# EAGLE design 2out_0-10V_2te (EAGLE 6.3)
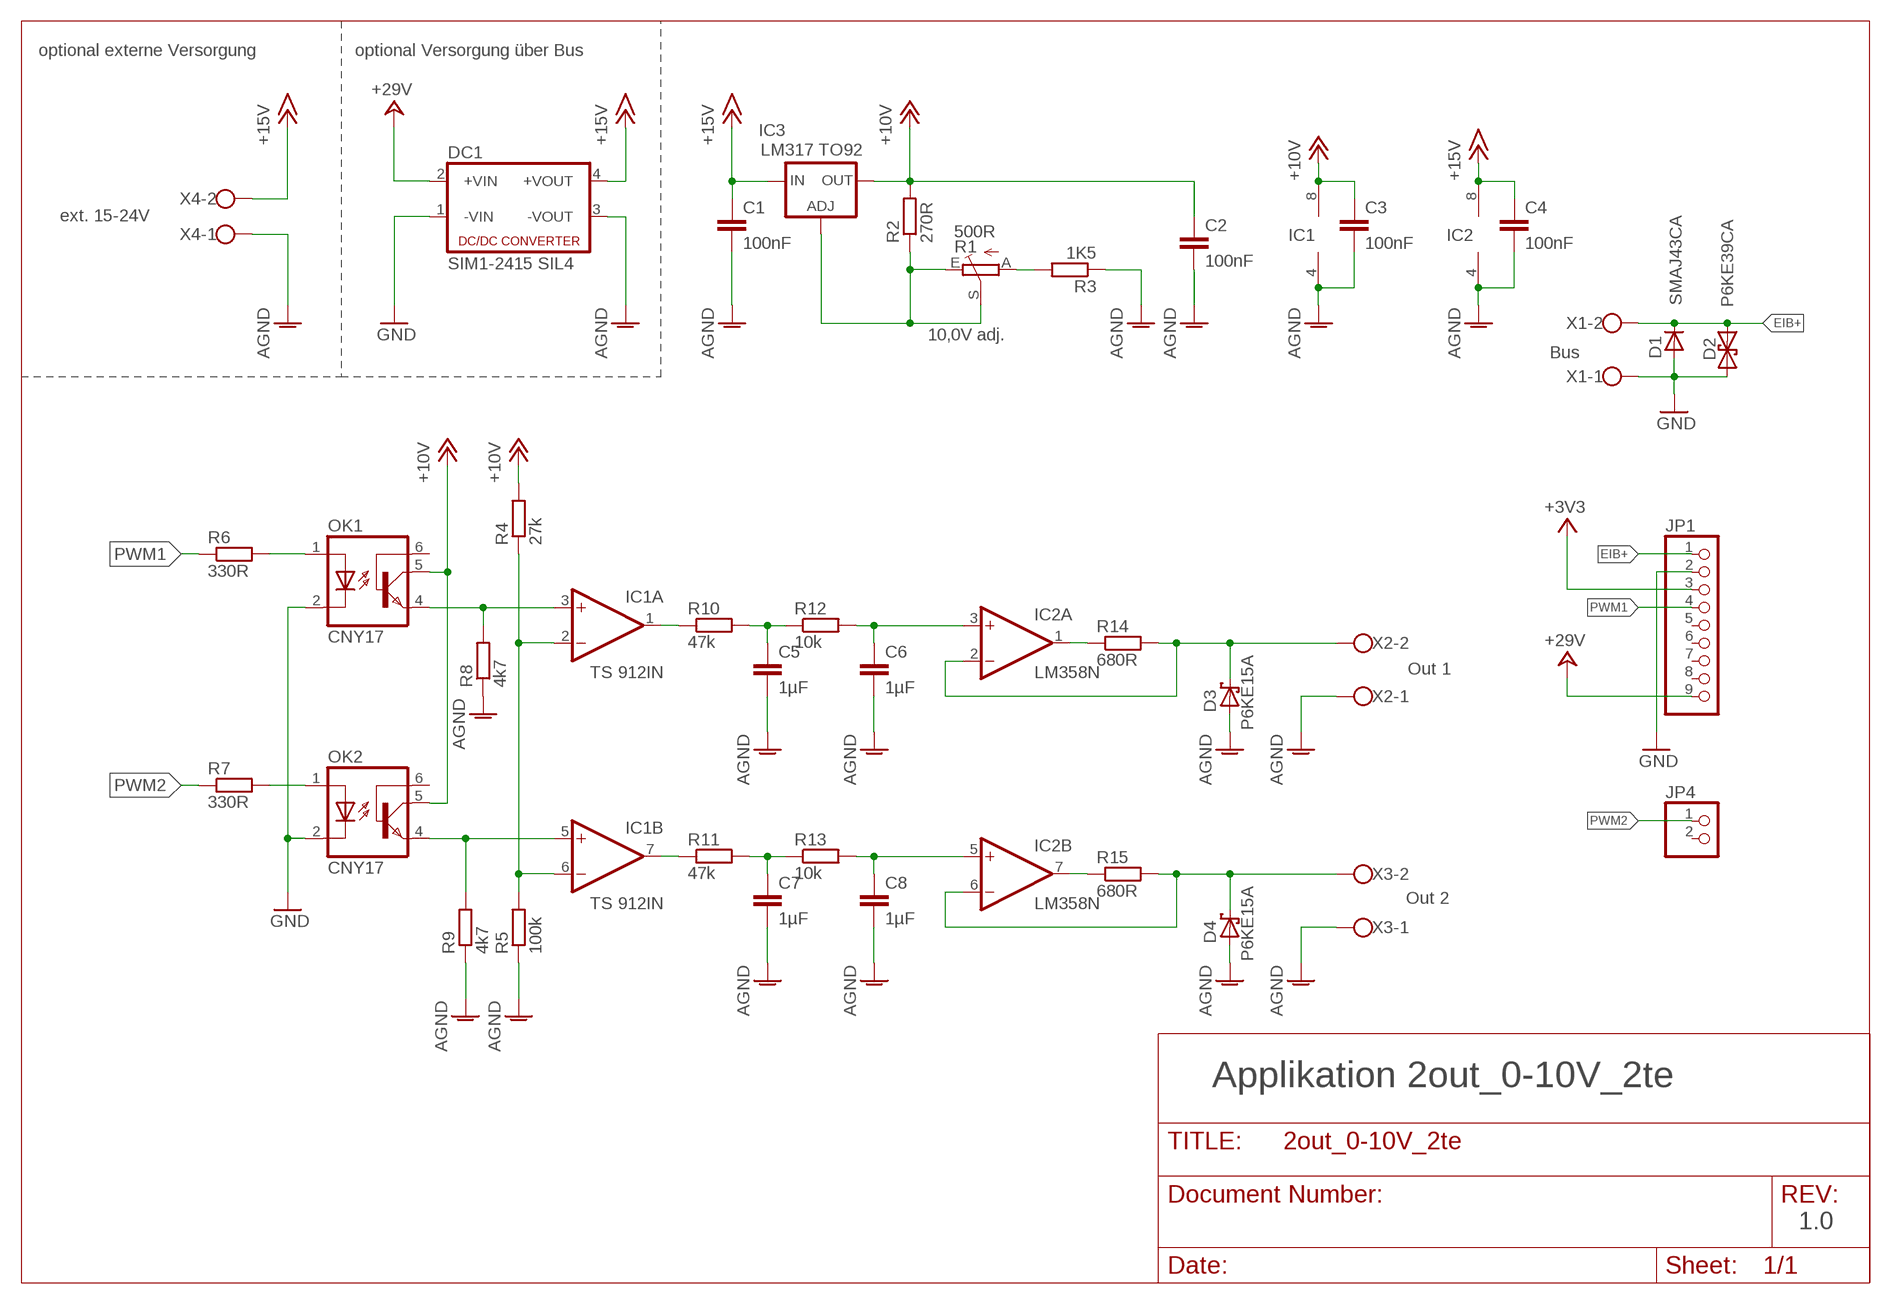
[diagram p0: schematic, sheet 1]

## Parts
C1  100nF  C-EU025-024X044  [C025-024X044]
C2  100nF  C-EU025-024X044  [C025-024X044]
C3  100nF  C-EU025-024X044  [C025-024X044]
C4  100nF  C-EU025-024X044  [C025-024X044]
C5  1µF  C-EU050-024X044  [C050-024X044]
C6  1µF  C-EU050-024X044  [C050-024X044]
C7  1µF  C-EU050-024X044  [C050-024X044]
C8  1µF  C-EU050-024X044  [C050-024X044]
D1  SMAJ43CA  D-SOD-87  [SOD87]
D2  P6KE39CA  P6KEXXCDO41-7  [DO41-7]
D3  P6KE15A  P6KEXXADO41-7  [DO41-7]
D4  P6KE15A  P6KEXXADO41-7  [DO41-7]
DC1  SIM1-2415 SIL4  NME  [NME]
IC1  TS 912IN  LM358N  [DIL08]
IC2  LM358N  [DIL08]
IC3  LM317 TO92  LM317L  [317L]
JP1  PINHD-1X9  [1X09]
JP4  PINHD-1X2  [1X02]
OK1  CNY17  [DIL06]
OK2  CNY17  [DIL06]
R1  500R  TRIM_EU-B64W  [B64W]
R2  270R  R-EU_0207/7  [0207/7]
R3  1K5  R-EU_0207/7  [0207/7]
R4  27k  R-EU_0207/7  [0207/7]
R5  100k  R-EU_0207/7  [0207/7]
R6  330R  R-EU_0207/7  [0207/7]
R7  330R  R-EU_0207/7  [0207/7]
R8  4k7  R-EU_0207/7  [0207/7]
R9  4k7  R-EU_0207/7  [0207/7]
R10  47k  R-EU_0207/7  [0207/7]
R11  47k  R-EU_0207/7  [0207/7]
R12  10k  R-EU_0207/7  [0207/7]
R13  10k  R-EU_0207/7  [0207/7]
R14  680R  R-EU_0207/7  [0207/7]
R15  680R  R-EU_0207/7  [0207/7]
X1  W237-02P  [W237-132]
X2  W237-02P  [W237-132]
X3  W237-02P  [W237-132]
X4  W237-02P  [W237-132]

## Nets
+3V3: JP1.3
+12V: C2.1 C3.1 IC1.8(P:V+) IC3.2(OUT) OK1.5(COL) OK2.5(COL) R2.2 R4.2 ; supply symbol labelled +10V
+15V: C1.1 C4.1 DC1.4(+VOUT) IC2.8(P:V+) IC3.3(IN) X4.2
+29V: DC1.2(+VIN) JP1.9
AGND: C1.2 C2.2 C3.2 C4.2 C5.2 C6.2 C7.2 C8.2 D3.A D4.A DC1.3(-VOUT) IC1.4(P:V-) IC2.4(P:V-) R3.1 R5.1 R8.1 R9.1 X2.1 X3.1 X4.1
EIB+: D1.1(C) D2.C JP1.1 X1.2
GND: D1.2(A) D2.A DC1.1(-VIN) JP1.2 OK1.2(C) OK2.2(C) X1.1
N$1: IC1.7(B:OUT) R11.1
N$2: OK2.1(A) R7.2
N$3: OK1.1(A) R6.2
N$4: C7.1 R11.2 R13.1
N$5: IC3.1(ADJ) R1.E R1.S R2.1
N$6: R1.A R3.2
N$7: IC1.3(A:+IN) OK1.4(EMI) R8.2
N$8: IC1.2(A:-IN) IC1.6(B:-IN) R4.1 R5.2
N$9: C8.1 IC2.5(B:+IN) R13.2
N$10: IC2.7(B:OUT) R15.1
N$11: IC1.5(B:+IN) OK2.4(EMI) R9.2
N$12: IC1.1(A:OUT) R10.1
N$13: C5.1 R10.2 R12.1
N$14: C6.1 IC2.3(A:+IN) R12.2
N$15: IC2.1(A:OUT) R14.1
OUT_1: D3.C IC2.2(A:-IN) R14.2 X2.2
OUT_2: D4.C IC2.6(B:-IN) R15.2 X3.2
PWM1: JP1.4 R6.1
PWM2: JP4.1 R7.1
Unconnected: JP1.5 JP1.6 JP1.7 JP1.8 JP4.2 OK1.6(BAS) OK2.6(BAS)

## Notes on the sheet
- optional externe Versorgung | optional Versorgung über Bus
- ext. 15-24V
- IC1 | IC2
- 10,0V adj.
- Bus
- Out 1
- Out 2
- Applikation 2out_0-10V_2te
- 1.0

## Library data of the parts
C1-C8 = rcl:C-EU: CAPACITOR, European symbol
D1 = semicon-smd-ipc:D-: DIODE unfilled
D2 = diode:P6KEXXC: DIODE transient-voltage suppressor
D3 D4 = diode:P6KEXXA: DIODE transient-voltage suppressor
DC1 = dc-dc-converter:NME: DC-DC CONVERTER
IC1 IC2 = linear:LM358: OP AMP also LM158; LM258; LM2904 Source: http://cache.national.com/ds/LM/LM158.pdf
IC3 = v-reg:LM317L: VOLTAGE REGULATOR
JP1 = pinhead:PINHD-1X9: PIN HEADER
JP4 = pinhead:PINHD-1X2: PIN HEADER
OK1 OK2 = Uwe:CNY17: SIEMENS OPTO COUPLER; MPN: CNY17-1; OC_FARNELL: 1045399; OC_NEWARK: 05M4044
R1 = pot:TRIM_EU-: POTENTIOMETER
R2-R15 = rcl:R-EU_: RESISTOR, European symbol
X1-X4 = con-wago-508:W237-02P: WAGO SREW CLAMP

## Board
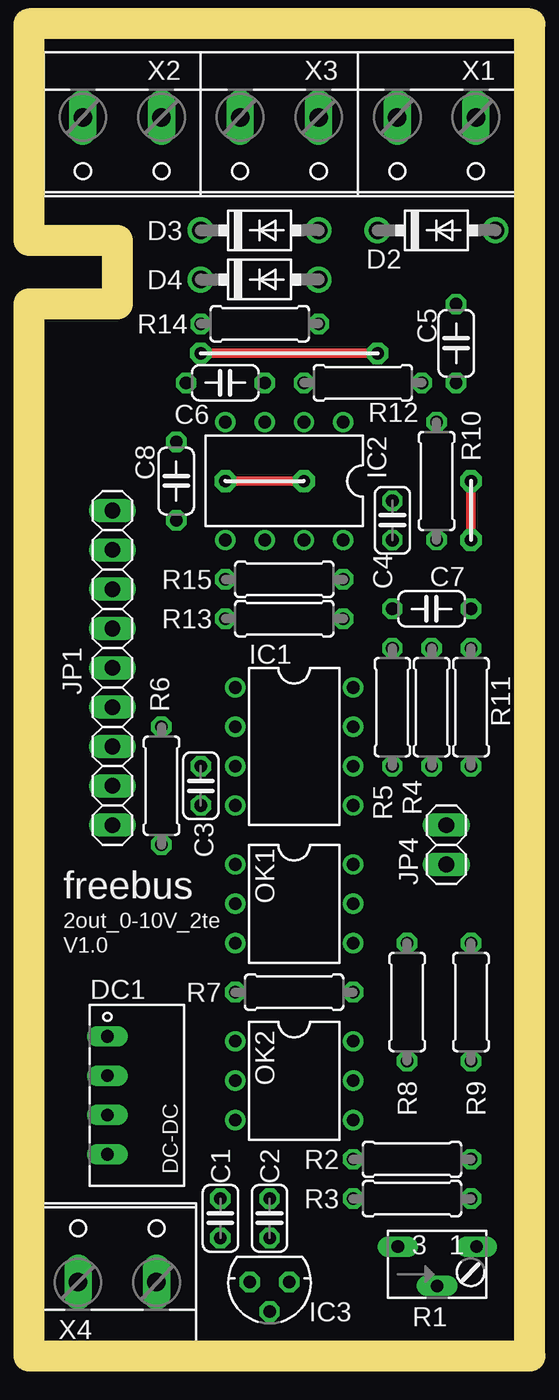
[diagram p1: board, top side]
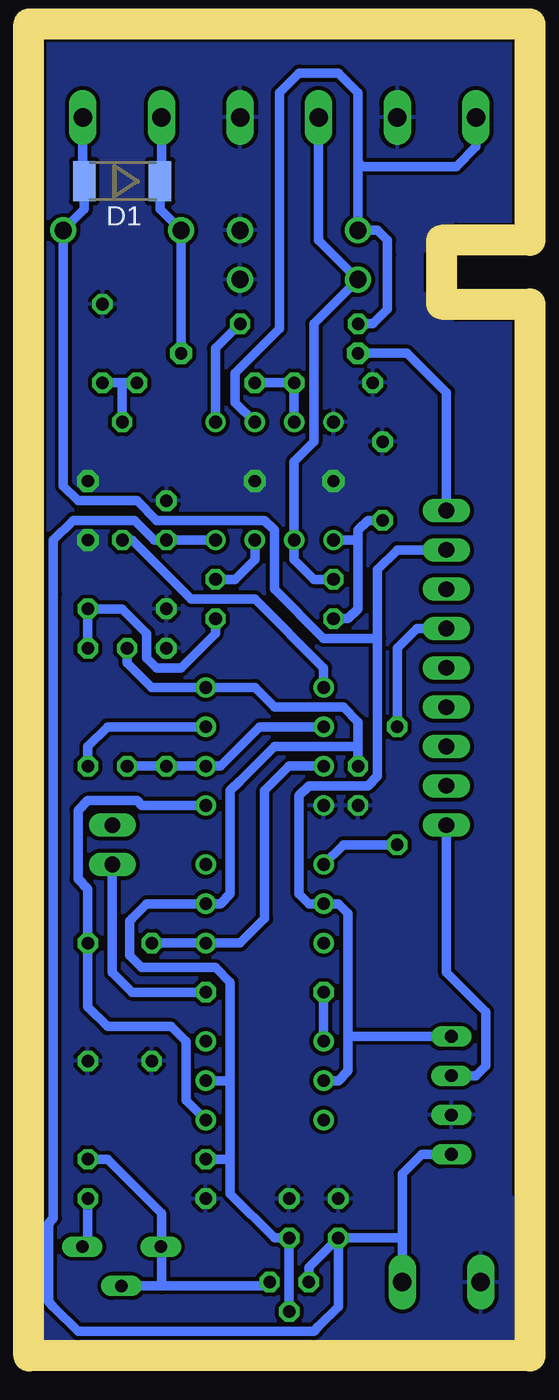
[diagram p2: board, bottom side, seen from below]

Size 31.11 x 85.41 mm. Coordinates in mm from the lower left corner, seen from the top.
Outline: 0,0 0,10.79 0.32,10.79 0.32,67.31 4.13,67.31 6.03,69.22 6.03,71.44 4.13,73.34 0.32,73.34 0.32,85.41 30.8,85.41 30.8,10.79 31.11,10.79 31.11,0 0,0
Copper layers (1*16): Top 0.035mm / dielectric 1.5mm / Bottom 0.035mm
Design rules "platinensammler_02 *": minimum track width 0.1mm, minimum drill 0.7mm, track to track 0.252mm, track to pad 0.252mm, pad to pad 0.252mm, via to via 0.252mm, smd to smd 0.252mm, copper to edge 0.2mm, drill to drill 0.2mm, minimum pad ring 0.25mm, minimum via ring 0.3mm, stop-mask expansion 4mil, vias tented up to drill 0.8mm, thermal gap 0.26mm
Milling: 8 lines

### Footprints (pad centres in the part's own frame; a part is rotated, then mirrored left to right if it is on the bottom)
C025-024X044 = drill 0.813 octagon: 1 -1.27,0; 2 1.27,0
C050-024X044 = drill 0.813 octagon: 1 -2.54,0; 2 2.54,0
SOD87 = smd 1.45 x 2.6: 1 -2.445,0; 2 2.445,0
DO41-7 = drill 1.118: A 3.81,0; C -3.81,0
NME = drill 0.813 long: 1 0,3.81; 2 0,1.27; 3 0,-1.27; 4 0,-3.81
DIL08 = drill 0.813 pad 1.27: 1 -3.81,-3.81; 2 -1.27,-3.81; 3 1.27,-3.81; 4 3.81,-3.81; 5 3.81,3.81; 6 1.27,3.81; 7 -1.27,3.81; 8 -3.81,3.81
317L = drill 0.813 octagon: 1 -1.27,0; 2 0,1.905; 3 1.27,0
1X09 = drill 1.016 long: 1 -10.16,0; 2 -7.62,0; 3 -5.08,0; 4 -2.54,0; 5 0,0; 6 2.54,0; 7 5.08,0; 8 7.62,0; 9 10.16,0
1X02 = drill 1.016 long: 1 0,0; 2 2.54,0
DIL06 = drill 0.813: 1 -2.54,-3.81; 2 0,-3.81; 3 2.54,-3.81; 4 2.54,3.81; 5 0,3.81; 6 -2.54,3.81
B64W = drill 0.813 long: A 2.54,0; E -2.54,0; S 0,-2.54
0207/7 = drill 0.813 octagon: 1 -3.81,0; 2 3.81,0
W237-132 = drill 1.194 long: 1 -2.54,-0.635; 2 2.54,-0.635

### Placement (x,y rotation side)
C1  11.75,9.21 90 top
C2  14.92,9.21 90 top
C3  10.48,37.15 270 top
C4  22.86,54.29 90 top
C5  26.99,65.72 90 top
C6  12.06,63.18 180 top
C7  25.4,48.58 180 top
C8  8.89,56.83 90 top
D1  25.72,76.2 180 bottom
D2  25.72,73.03 0 top
D3  14.29,73.03 0 top
D4  14.29,69.85 0 top
DC1  4.45,17.14 0 top
IC1  16.51,39.69 270 top
IC2  15.88,56.83 180 top
IC3  14.92,5.08 180 top
JP1  4.76,44.77 270 top
JP4  26.35,32.07 90 top
OK1  16.51,29.53 270 top
OK2  16.51,18.1 270 top
R1  25.76,7.38 0 top
R2  24.13,13.02 180 top
R3  24.13,10.48 0 top
R4  25.4,42.23 90 top
R5  22.86,42.23 270 top
R6  7.94,37.15 270 top
R7  16.51,23.81 180 top
R8  23.81,23.18 90 top
R9  27.94,23.18 90 top
R10  25.72,56.83 90 top
R11  27.94,42.23 90 top
R12  20.95,63.18 180 top
R13  15.88,47.94 180 top
R14  14.29,66.99 180 top
R15  15.88,50.48 180 top
X1  25.72,79.69 180 top
X2  5.4,79.69 180 top
X3  15.56,79.69 180 top
X4  5.08,5.71 0 top

### Tracks (layer width: path | path; a pad name or v marks a point on that pad's centre or on a via)
+12V
  Bottom 0.61: IC3.2 C2.1 15.88,7.94 18.73,10.79 18.73,13.02 | 18.73,18.1 18.73,24.45 19.68,25.4 24.45,25.4 25.24,26.19 25.24,28.42 25.08,28.57 24.13,29.53 OK1.5 19.37,29.53 18.73,30.16 18.73,36.83 18.1,37.47 15.88,39.69 10.48,39.69 | 18.73,18.1 18.73,17.46 18.73,13.02 | OK2.5 18.73,18.1 | R4.2 25.4,45.09 23.81,43.5 IC1.8 17.14,43.5 15.88,42.23 11.43,42.23 10.48,41.27 10.48,39.69 | 10.48,39.69 C3.1 | R2.2 18.73,13.02
+15V
  Bottom 0.61: IC3.3 13.65,6.03 C1.1 | C1.1 11.75,3.49 13.02,2.22 13.34,1.91 28.57,1.91 30.16,3.49 30.48,3.81 30.48,8.89 30.16,9.21 30.16,49.53 30.16,53.02 28.89,54.29 24.92,54.29 23.65,53.02 C4.1 IC2.8 | DC1.4 6.35,13.34 7.62,12.06 7.62,7.94 | 7.62,7.94 X4.2 | C1.1 7.62,7.94
+29V
  Bottom 0.61: DC1.2 3.17,18.41 2.86,18.41 2.22,19.05 2.22,22.54 4.76,25.08 JP1.9
AGND  (via drill 0.8)
  Top 0.61: v17.14,56.83 v12.06,56.83 | v27.94,56.83 v27.94,53.02
  pour Bottom (isolate 0.1, rank 6): 0,0 30.8,0 30.8,85.41 0,85.41 0.32,73.34 4.13,73.34 6.03,71.44 6.03,69.22 4.13,67.31 0.32,67.31
EIB+  (via drill 0.8)
  Top 0.61: v10.48,65.09 v21.91,65.09
  Bottom 0.61: X1.2 23.18,76.3 D1.1 23.27,74.39 D2.C v21.91,65.09 | JP1.1 4.76,62.55 7.3,65.09 v10.48,65.09
GND
  Bottom 0.61: OK2.2 11.75,18.1 11.11,18.73 11.11,20.95 | 11.11,20.95 11.11,28.89 11.75,29.53 OK1.2 13.65,29.53 14.29,30.16 14.29,36.51 13.65,37.15 9.84,37.15 9.21,37.78 9.21,46.67 | DC1.1 11.11,20.95 | 9.21,46.67 9.21,51.12 7.94,52.39 JP1.2 | 9.21,46.67 12.7,46.67 15.88,49.85 15.88,53.02 15.88,53.66 16.51,54.29 23.5,54.29 24.77,55.56 28.57,55.56 29.53,56.52 D2.A 28.16,74.39 D1.2 28.26,76.3 X1.1
N$1
  Bottom 0.61: IC1.7 26.67,40.96 27.94,39.69 R11.1
N$2
  Bottom 0.61: R7.2 OK2.1
N$3
  Bottom 0.61: R6.2 11.43,33.34 OK1.1
N$4
  Bottom 0.61: R13.1 19.68,46.99 21.91,44.77 23.5,44.77 24.13,45.4 24.13,46.99 25.72,48.58 C7.1 R11.2
N$5
  Bottom 0.61: R2.1 26.67,13.02 23.18,9.53 23.18,7.42 R1.E 23.18,7.33 23.18,4.83 | IC3.1 16.44,4.83 23.18,4.83 | 23.18,4.83 R1.S
N$6
  Bottom 0.61: R3.2 27.94,7.74 R1.A
N$7
  Bottom 0.61: IC1.3 14.92,38.42 16.51,36.83 16.51,28.57 18.1,26.99 OK1.4 R8.2
N$8
  Bottom 0.61: R4.1 R5.2 IC1.6 19.37,38.42 16.83,40.96 IC1.2
N$9
  Bottom 0.61: R13.2 11.11,47.94 10.48,48.58 10.48,53.02 | IC2.5 10.48,53.02 | C8.1 9.84,54.29 10.48,53.66 10.48,53.02
N$10
  Bottom 0.61: IC2.7 17.14,51.75 18.41,50.48 R15.1
N$11
  Bottom 0.61: OK2.4 21.59,16.83 21.59,20.32 21.59,20.64 22.54,21.59 26.67,21.59 27.94,22.86 R9.2 27.94,30.48 28.57,31.11 28.57,35.56 27.94,36.2 24.77,36.2 24.45,35.88 IC1.5
N$12
  Bottom 0.61: IC1.1 12.7,44.77 17.14,49.21 21.27,49.21 25.08,53.02 R10.1
N$13
  Bottom 0.61: C5.1 25.72,63.18 | 25.72,63.18 R12.1 | R10.2 25.72,63.18
N$14
  Bottom 0.61: R12.2 C6.1 IC2.3
N$15
  Bottom 0.61: R14.1 19.68,65.41 IC2.1
OUT_1
  Bottom 0.61: IC2.2 18.41,61.91 18.41,63.82 15.56,66.67 15.56,81.92 14.29,83.19 11.75,83.19 10.48,81.92 10.48,77.47 | 10.48,77.47 D3.C 9.21,73.03 8.57,72.39 8.57,71.44 8.57,67.94 9.53,66.99 R14.2 | X2.2 2.86,78.42 4.13,77.15 10.16,77.15 10.48,77.47
OUT_2
  Bottom 0.61: R15.2 13.34,50.48 14.61,51.75 IC2.6 14.61,58.1 13.34,59.37 13.34,66.99 D4.C 13.02,72.39 X3.2
PWM1
  Bottom 0.61: JP1.4 6.67,47.31 7.94,46.04 R6.1
PWM2
  Bottom 0.61: JP4.1 26.35,25.08 25.08,23.81 R7.1

### Text on the board
tPlace: freebus | 2out_0-10V_2te | V1.0